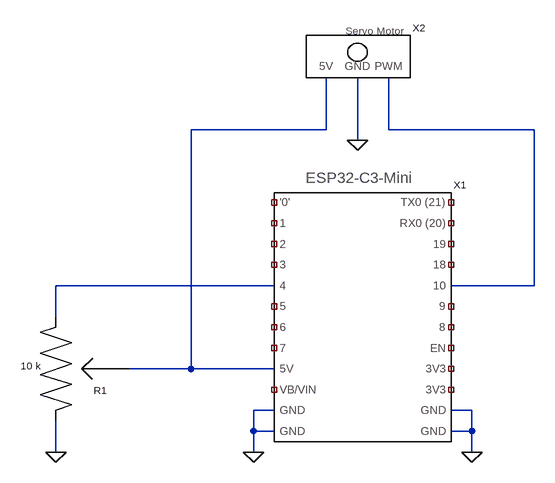
[diagram p0: schematic potControlServo.asc]
potControlServo.asc, the LTspice schematic file:
Version 4.1
SHEET 1 880 680
WIRE 192 -80 192 -160
WIRE 192 -80 -16 -80
WIRE 288 -80 288 -160
WIRE 512 -80 288 -80
WIRE 240 -64 240 -160
WIRE 112 160 -224 160
WIRE 512 160 512 -80
WIRE 512 160 384 160
WIRE -224 208 -224 160
WIRE -16 288 -16 -80
WIRE -16 288 -112 288
WIRE 112 288 -16 288
WIRE 112 352 80 352
WIRE 416 352 384 352
WIRE 80 384 80 352
WIRE 112 384 80 384
WIRE 416 384 416 352
WIRE 416 384 384 384
WIRE -224 416 -224 368
WIRE 80 416 80 384
WIRE 416 416 416 384
FLAG -224 416 0
FLAG 80 416 0
FLAG 416 416 0
FLAG 240 -64 0
SYMBOL symbols\\ESP32-C3-Mini 160 96 R0
SYMATTR InstName X1
SYMBOL symbols\\servoMotor 224 -160 R0
SYMATTR InstName X2
SYMBOL symbols\\Potentiometer -160 352 R0
SYMATTR Value 10 k
SYMATTR InstName R1

The netlist it stands for:
* potControlServo.asc
X§X1 NC_01 NC_02 NC_03 NC_04 N003 NC_05 NC_06 NC_07 N001 NC_08 0 0 NC_09 NC_10 NC_11 NC_12 N002 NC_13 NC_14 NC_15 NC_16 NC_17 0 0 ESP32-C3-Mini  ; pins '0' 1 2 3 4 5 6 7 5V VB/VIN GND GND TX0_(21) RX0_(20) 19 18 10 9 8 EN 3V3 3V3 GND GND
X§X2 N001 0 N002 servoMotor  ; pins 5V GND PWM
R1 N001 0 N003 10 k
.backanno
.end